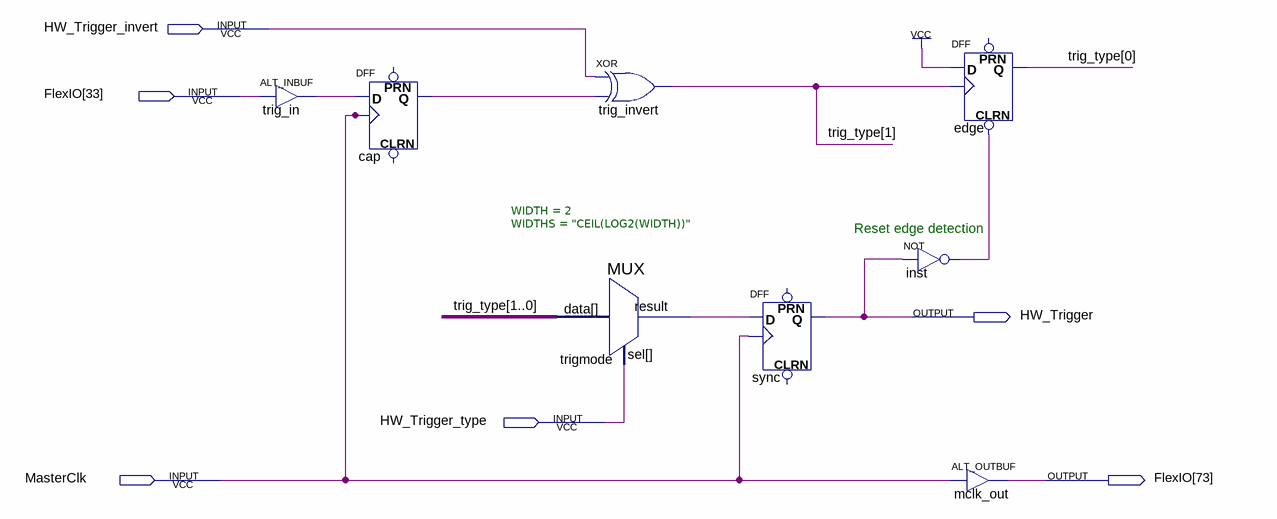
[diagram p0: schematic sheet]
// Quartus schematic IOLines.bdf as structural Verilog: 8 symbols, 6 pins
module IOLines (
  input  HW_Trigger_invert,
  inout  [73:33] FlexIO,
  input  HW_Trigger_type,
  input  MasterClk,
  output HW_Trigger
);

  wire cap_q, inst_out, trig_in_o, trigmode_result;
  wire [1:0] trig_type;

  ALT_INBUF trig_in (.i(FlexIO[33]), .o(trig_in_o));
  DFF cap (.CLK(MasterClk), .D(trig_in_o), .Q(cap_q));  // open: CLRN, PRN
  MUX #(.WIDTH(2), .WIDTHS("CEIL(LOG2(WIDTH))")) trigmode (
    .data(trig_type), .sel(HW_Trigger_type), .result(trigmode_result));
  xor trig_invert (trig_type[1], HW_Trigger_invert, cap_q);
  DFF sync (.CLK(MasterClk), .D(trigmode_result), .Q(HW_Trigger));  // open: CLRN, PRN
  DFF \edge  (.CLRN(inst_out), .CLK(trig_type[1]), .D(1'b1), .Q(trig_type[0]));  // open: PRN
  not inst (inst_out, HW_Trigger);
  ALT_OUTBUF mclk_out (.i(MasterClk), .o(FlexIO[73]));

  // Notes on the sheet:
  //   Reset edge detection
endmodule
